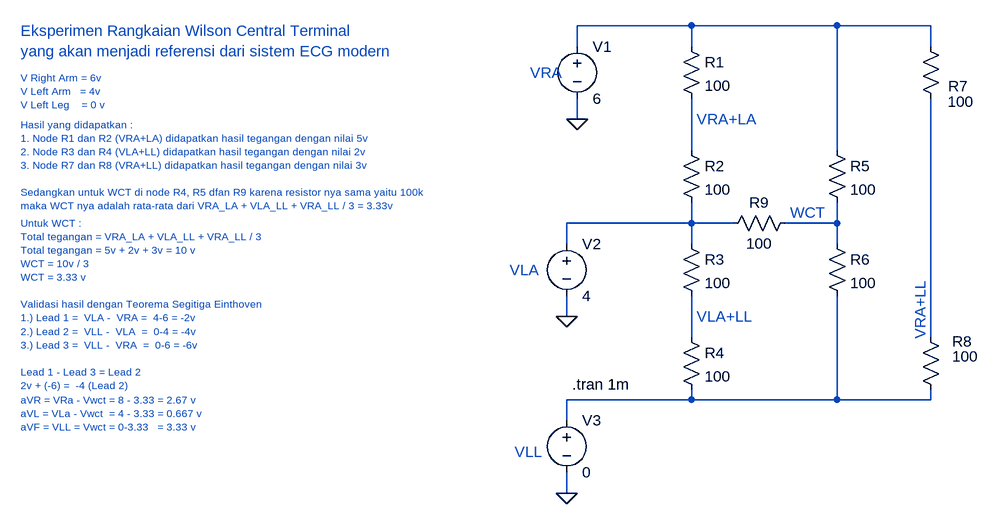
[diagram p0: schematic Wilson_Central_Terminal.asc]
Wilson_Central_Terminal.asc, the LTspice schematic file:
Version 4
SHEET 1 956 748
WIRE 96 -16 -80 -16
WIRE 320 -16 96 -16
WIRE 464 -16 320 -16
WIRE -80 16 -80 -16
WIRE 96 16 96 -16
WIRE 464 16 464 -16
WIRE -80 128 -80 96
WIRE 96 176 96 96
WIRE 320 176 320 -16
WIRE 96 288 96 256
WIRE 96 288 -96 288
WIRE 160 288 96 288
WIRE 320 288 320 256
WIRE 320 288 240 288
WIRE -96 320 -96 288
WIRE 96 320 96 288
WIRE 320 320 320 288
WIRE -96 432 -96 400
WIRE 96 464 96 400
WIRE 464 464 464 96
WIRE 96 560 96 544
WIRE 96 560 -96 560
WIRE 320 560 320 400
WIRE 320 560 96 560
WIRE 464 560 464 544
WIRE 464 560 320 560
WIRE -96 592 -96 560
WIRE -96 704 -96 672
FLAG -80 128 0
FLAG -96 432 0
FLAG -96 704 0
DATAFLAG 96 128 ""
DATAFLAG 96 432 ""
DATAFLAG 464 176 ""
DATAFLAG 320 288 ""
SYMBOL res 80 0 R0
SYMATTR InstName R1
SYMATTR Value 100
SYMBOL res 80 160 R0
SYMATTR InstName R2
SYMATTR Value 100
SYMBOL res 80 304 R0
SYMATTR InstName R3
SYMATTR Value 100
SYMBOL res 80 448 R0
SYMATTR InstName R4
SYMATTR Value 100
SYMBOL res 304 160 R0
SYMATTR InstName R5
SYMATTR Value 100
SYMBOL res 304 304 R0
SYMATTR InstName R6
SYMATTR Value 100
SYMBOL res 448 0 R0
WINDOW 0 43 77 Left 2
WINDOW 3 42 101 Left 2
SYMATTR InstName R7
SYMATTR Value 100
SYMBOL res 448 448 R0
WINDOW 0 49 22 Left 2
WINDOW 3 49 45 Left 2
SYMATTR InstName R8
SYMATTR Value 100
SYMBOL res 256 272 R90
WINDOW 0 0 56 VBottom 2
WINDOW 3 32 56 VTop 2
SYMATTR InstName R9
SYMATTR Value 100
SYMBOL voltage -80 0 R0
WINDOW 123 0 0 Left 0
WINDOW 39 0 0 Left 0
SYMATTR InstName V1
SYMATTR Value 6
SYMBOL voltage -96 304 R0
WINDOW 123 0 0 Left 0
WINDOW 39 0 0 Left 0
SYMATTR InstName V2
SYMATTR Value 4
SYMBOL voltage -96 576 R0
WINDOW 123 0 0 Left 0
WINDOW 39 0 0 Left 0
SYMATTR InstName V3
SYMATTR Value 0
TEXT -88 536 Left 2 !.tran 1m
TEXT -152 56 Left 2 ;VRA
TEXT -184 360 Left 2 ;VLA
TEXT -176 640 Left 2 ;VLL
TEXT 104 128 Left 2 ;VRA+LA
TEXT 104 432 Left 2 ;VLA+LL
TEXT 448 376 VRight 2 ;VRA+LL
TEXT 248 272 Left 2 ;WCT
TEXT -936 -8 Left 2 ;Eksperimen Rangkaian Wilson Central Terminal\nyang akan menjadi referensi dari sistem ECG modern
TEXT -936 64 Left 1 ;V Right Arm = 6v\nV Left Arm   = 4v\nV Left Leg    = 0 v
TEXT -936 136 Left 1 ;Hasil yang didapatkan : \n1. Node R1 dan R2 (VRA+LA) didapatkan hasil tegangan dengan nilai 5v\n2. Node R3 dan R4 (VLA+LL) didapatkan hasil tegangan dengan nilai 2v \n3. Node R7 dan R8 (VRA+LL) didapatkan hasil tegangan dengan nilai 3v \n \nSedangkan untuk WCT di node R4, R5 dfan R9 karena resistor nya sama yaitu 100k\nmaka WCT nya adalah rata-rata dari VRA_LA + VLA_LL + VRA_LL / 3 = 3.33v
TEXT -936 288 Left 1 ;Untuk WCT :\nTotal tegangan = VRA_LA + VLA_LL + VRA_LL / 3\nTotal tegangan = 5v + 2v + 3v = 10 v \nWCT = 10v / 3 \nWCT = 3.33 v\n \nValidasi hasil dengan Teorema Segitiga Einthoven\n1.) Lead 1 =  VLA -  VRA =  4-6 = -2v \n2.) Lead 2 =  VLL -  VLA  =  0-4 = -4v\n3.) Lead 3 =  VLL -  VRA  =  0-6 = -6v\n \nLead 1 - Lead 3 = Lead 2 \n2v + (-6) =  -4 (Lead 2)
TEXT -936 560 Left 1 ;aVR = VRa - Vwct = 8 - 3.33 = 2.67 v\naVL = VLa - Vwct  = 4 - 3.33 = 0.667 v\naVF = VLL = Vwct = 0-3.33   = 3.33 v

The netlist it stands for:
* Wilson_Central_Terminal.asc
R1 N001 N002 100
R2 N002 N003 100
R3 N003 N005 100
R4 N005 N007 100
R5 N001 N004 100
R6 N004 N007 100
R7 N001 N006 100
R8 N006 N007 100
R9 N004 N003 100
V1 N001 0 6
V2 N003 0 4
V3 N007 0 0
.tran 1m
* VRA
* VLA
* VLL
* VRA+LA
* VLA+LL
* VRA+LL
* WCT
* Eksperimen Rangkaian Wilson Central Terminal
* yang akan menjadi referensi dari sistem ECG modern
* V Right Arm = 6v
* V Left Arm   = 4v
* V Left Leg    = 0 v
* Hasil yang didapatkan :
* 1. Node R1 dan R2 (VRA+LA) didapatkan hasil tegangan dengan nilai 5v
* 2. Node R3 dan R4 (VLA+LL) didapatkan hasil tegangan dengan nilai 2v
* 3. Node R7 dan R8 (VRA+LL) didapatkan hasil tegangan dengan nilai 3v
* Sedangkan untuk WCT di node R4, R5 dfan R9 karena resistor nya sama yaitu 100k
* maka WCT nya adalah rata-rata dari VRA_LA + VLA_LL + VRA_LL / 3 = 3.33v
* Untuk WCT :
* Total tegangan = VRA_LA + VLA_LL + VRA_LL / 3
* Total tegangan = 5v + 2v + 3v = 10 v
* WCT = 10v / 3
* WCT = 3.33 v
* Validasi hasil dengan Teorema Segitiga Einthoven
* 1.) Lead 1 =  VLA -  VRA =  4-6 = -2v
* 2.) Lead 2 =  VLL -  VLA  =  0-4 = -4v
* 3.) Lead 3 =  VLL -  VRA  =  0-6 = -6v
* Lead 1 - Lead 3 = Lead 2
* 2v + (-6) =  -4 (Lead 2)
* aVR = VRa - Vwct = 8 - 3.33 = 2.67 v
* aVL = VLa - Vwct  = 4 - 3.33 = 0.667 v
* aVF = VLL = Vwct = 0-3.33   = 3.33 v
.backanno
.end